# EAGLE design AFC_senser_carrier_v3a (EAGLE 9.6.2)

## Sheet 1 of 4: Power regulation 7V, 5V, 3.3V

## Sheet 2 of 4: 3 of TGS26XX sensors, 1 NGM2611E13, 16bit ADS1115
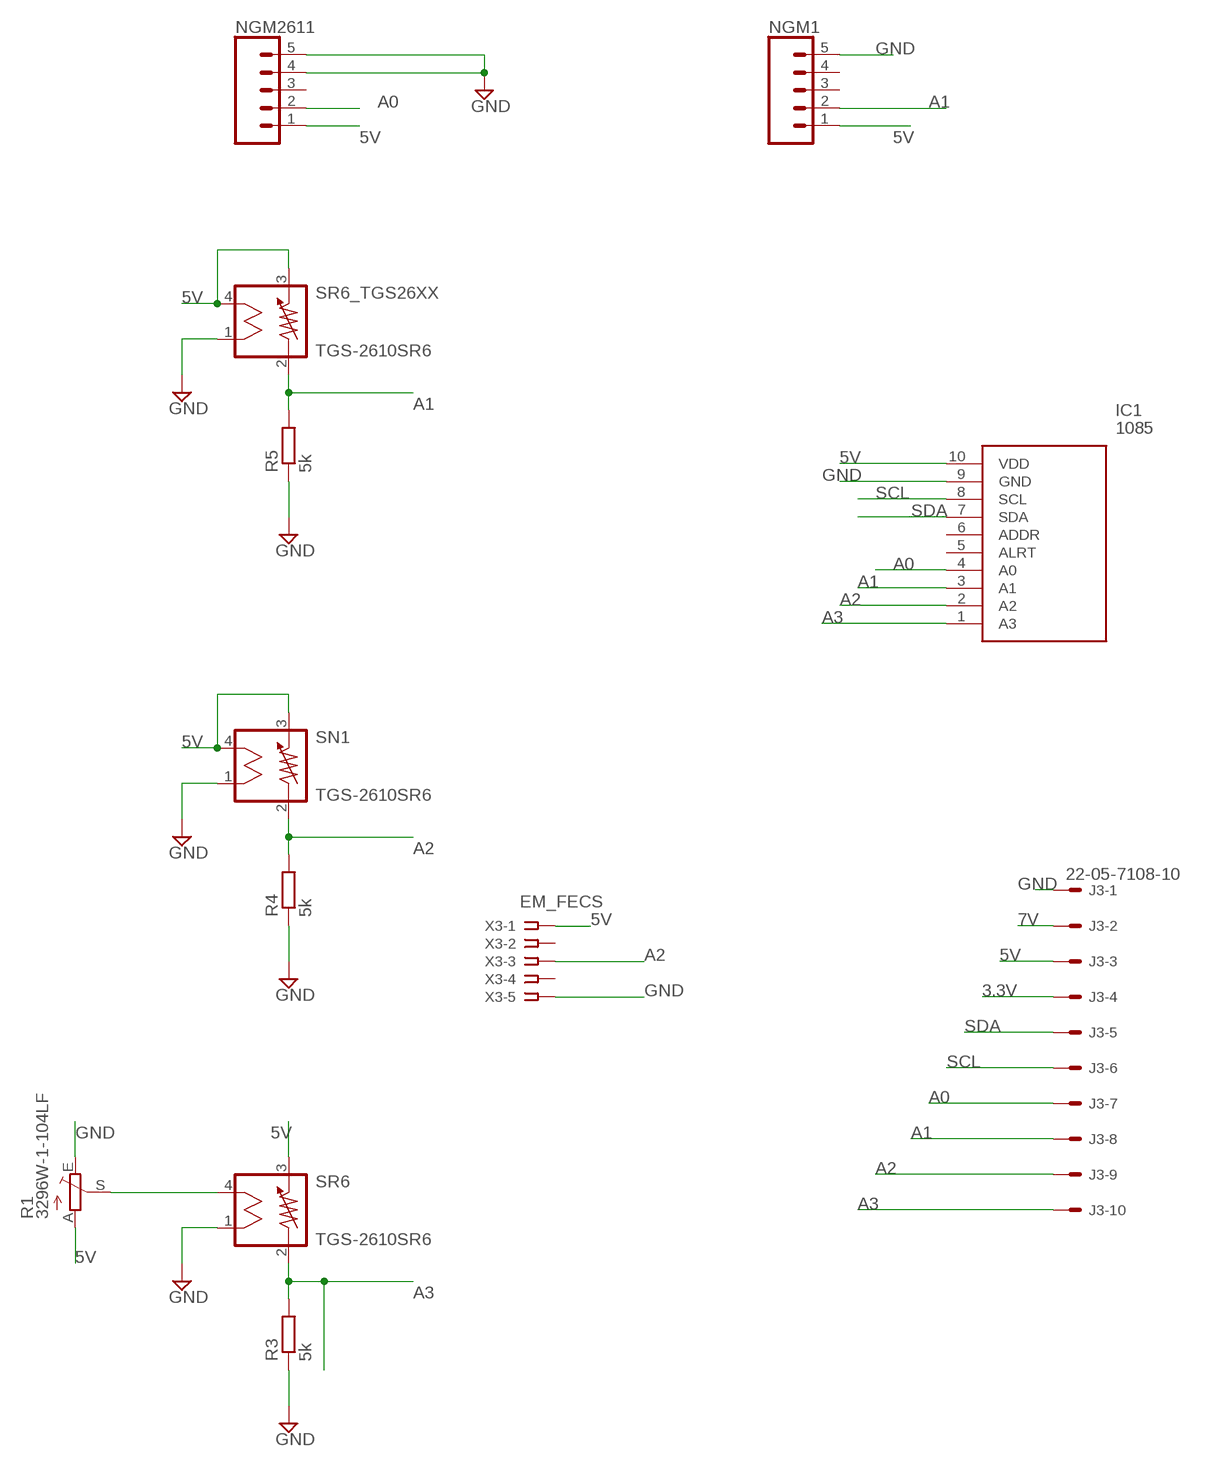
[diagram p0: schematic, sheet 2]

### Parts
IC1  1085  [1085]
J3  22-05-7108-10  [7395-10]
NGM1  CONN_05LOCK  [1X05_LOCK]
NGM2611  CONN_05LOCK  [1X05_LOCK]
R1  3296W-1-104LF  TRIM_EU-S64W  [S64W]
R3  5k  R-EU_R0805  [R0805]
R4  5k  R-EU_R0805  [R0805]
R5  5k  R-EU_R0805  [R0805]
SN1  TGS-2610SR6  [SR6_TGS26XX]
SR6  TGS-2610SR6  [SR6_TGS26XX]
SR6_TGS26XX  TGS-2610SR6  [SR6_TGS26XX]
X3  EM_FECS  SSW-105-02-G-S  [SSW-105-02-G-S]

### Nets
3.3V: J3.4 ; also sheet 3,4
5V [supply]: IC1.10(VDD) J3.3 NGM1.1 NGM2611.1 R1.A SN1.3 SN1.4 SR6.3 SR6_TGS26XX.3 SR6_TGS26XX.4 X3.1 ; also sheet 3
7V: J3.2 ; also sheet 3,4
A0: IC1.4(A0) J3.7 NGM2611.2
A1: IC1.3(A1) J3.8 NGM1.2 R5.2 SR6_TGS26XX.2
A2: IC1.2(A2) J3.9 R4.2 SN1.2 X3.3
A3: IC1.1(A3) J3.10 R3.2 SR6.2
GND: IC1.9(GND) J3.1 NGM1.5 NGM2611.4 NGM2611.5 R1.E R3.1 R4.1 R5.1 SN1.1 SR6.1 SR6_TGS26XX.1 X3.5 ; also sheet 3,4
N$1: R1.S SR6.4
SCL: IC1.8(SCL) J3.6 ; also sheet 3,4
SDA: IC1.7(SDA) J3.5 ; also sheet 3,4
Unconnected: IC1.5(ALRT) IC1.6(ADDR) NGM1.3 NGM1.4 NGM2611.3 X3.2 X3.4

## Sheet 3 of 4: K33, SHT85, BME680_3660 sensors
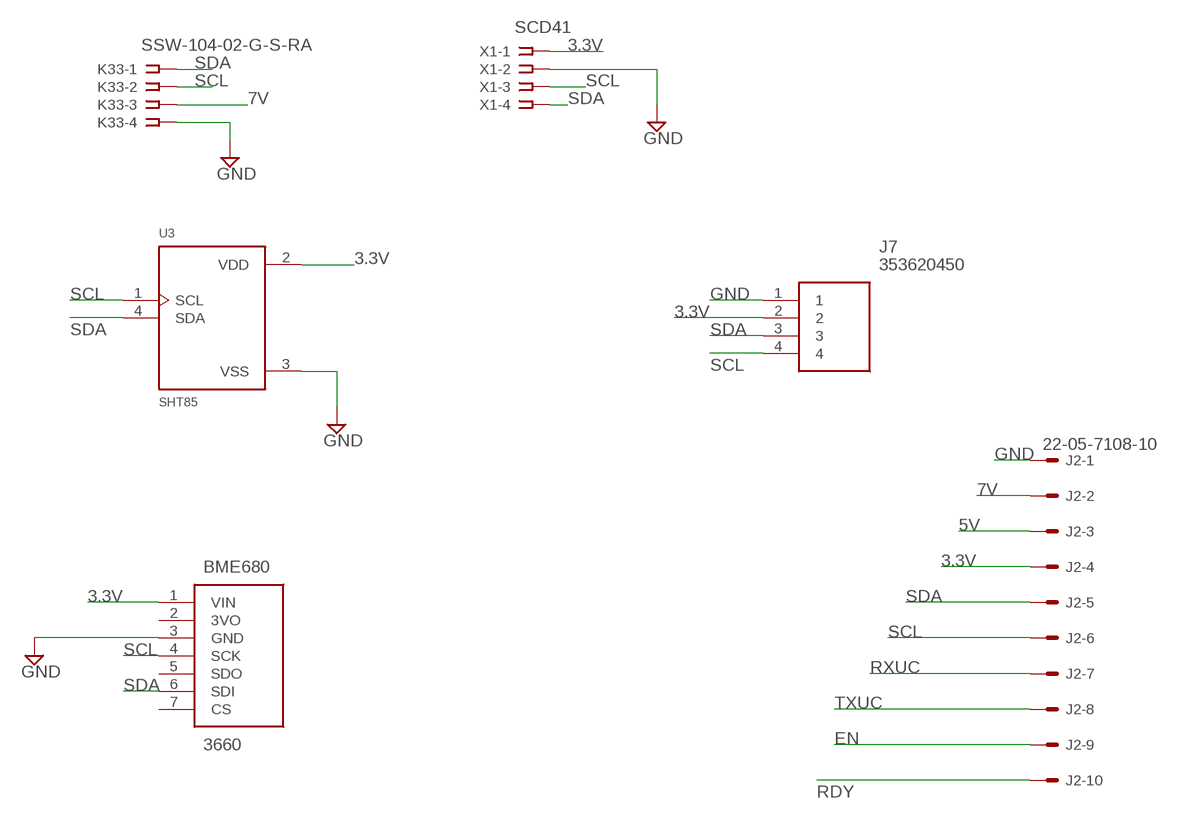
[diagram p1: schematic, sheet 3]

### Parts
BME680  3660  [3660]
J2  22-05-7108-10  [7395-10]
J7  353620450  [SHDR4W50P0X200_1X4_1030X550X85]
K33  SSW-104-02-G-S-RA  [SSW-104-02-G-S-RA]
U3  SHT85  [XDCR_SHT85]
X1  SCD41  SSW-104-02-G-S  [SSW-104-02-G-S]

### Nets
3.3V: BME680.1(VIN) J2.4 J7.2 U3.2(VDD) X1.1 ; also sheet 2,4
5V [supply]: J2.3 ; also sheet 2
7V: J2.2 K33.3 ; also sheet 2,4
EN: J2.9 ; also sheet 4
GND: BME680.3(GND) J2.1 J7.1 K33.4 U3.3(VSS) X1.2 ; also sheet 2,4
RDY: J2.10 ; also sheet 4
RXUC: J2.7 ; also sheet 4
SCL: BME680.4(SCK) J2.6 J7.4 K33.2 U3.1(SCL) X1.3 ; also sheet 2,4
SDA: BME680.6(SDI) J2.5 J7.3 K33.1 U3.4(SDA) X1.4 ; also sheet 2,4
TXUC: J2.8 ; also sheet 4
Unconnected: BME680.2(3VO) BME680.5(SDO) BME680.7(CS)

## Sheet 4 of 4: Arduino MKR, Sunrise, K96
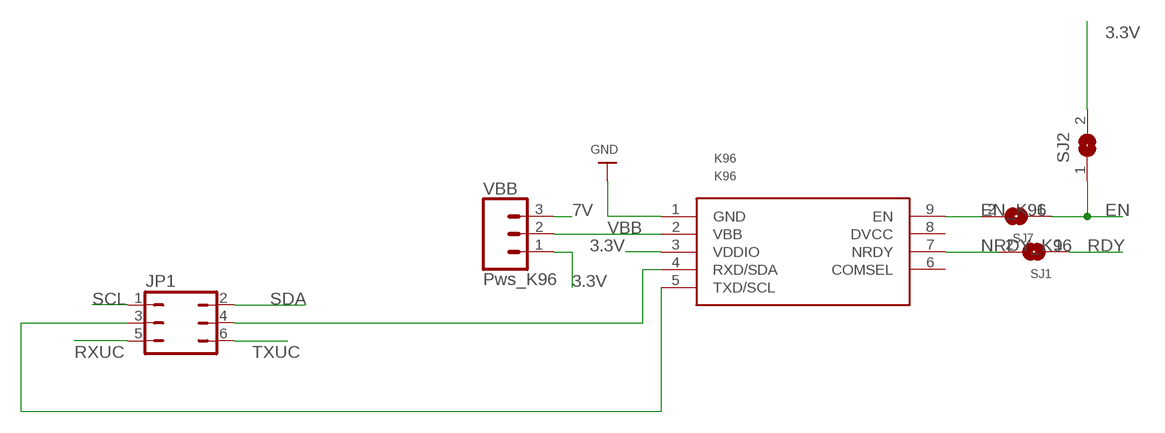
[diagram p2: schematic, sheet 4]

### Parts
JP1  JP3Q  [JP3Q]
K96  K96  SENSEAIR_SUNRISESUNRISE  [SENSEAIR_SUNRISE]
SJ1  SOLDERJUMPERCLOSED  [SOLDERJUMPER_CLOSEDWIRE]
SJ2  SJ  [SJ]
SJ7  SOLDERJUMPERCLOSED  [SOLDERJUMPER_CLOSEDWIRE]
VBB  Pws_K96  CONN_03  [1X03]

### Nets
3.3V: K96.3(VDDIO) SJ2.2 VBB.1 ; also sheet 2,3
7V: VBB.3 ; also sheet 2,3
EN: SJ2.1 SJ7.1 ; also sheet 3
EN_K96: K96.9(EN) SJ7.2
GND: K96.1(GND) ; also sheet 2,3
NRDY_K96: K96.7(NRDY) SJ1.2
RDY: SJ1.1 ; also sheet 3
RX_MKR: JP1.3 K96.5(TXD/SCL)
RXUC: JP1.5 ; also sheet 3
SCL: JP1.1 ; also sheet 2,3
SDA: JP1.2 ; also sheet 2,3
TX_MKR: JP1.4 K96.4(RXD/SDA)
TXUC: JP1.6 ; also sheet 3
VBB: K96.2(VBB) VBB.2
Unconnected: K96.6(COMSEL) K96.8(DVCC)

## Library data of the parts
BME680 = SamacSys_Parts:3660: Multiple Function Sensor Development Tools Adafruit BME680 - T, H, P & G Sensor Source: Datasheet <https://cdn-learn.adafruit.com/downloads/pdf/adafruit-bme680-humidity-temperature-barometic-pressure-voc-gas.pdf>; ARROW_PART_NUMBER: 3660; ARROW_PRICE-STOCK: https://www.arrow.com/en/products/3660/adafruit-industries; DESCRIPTION: Multiple Function Sensor Development Tools Adafruit BME680 - T, H, P & G Sensor; HEIGHT: 4mm; MANUFACTURER_NAME: Adafruit; MANUFACTURER_PART_NUMBER: 3660; MOUSER_PART_NUMBER: 485-3660; MOUSER_PRICE-STOCK: https://www.mouser.co.uk/ProductDetail/Adafruit/3660?qs=W0yvOO0ixfFypXCClAyRMg%3D%3D
IC1 = SamacSys_Parts:1085: Data Conversion IC Development Tools ADS1115 16-Bit ADC - 4 Channel with Programmable Gain Amplifier Source: Datasheet <https://cdn-shop.adafruit.com/datasheets/ads1115.pdf>; ARROW_PART_NUMBER: 1085; ARROW_PRICE-STOCK: https://www.arrow.com/en/products/1085/adafruit-industries; DESCRIPTION: Data Conversion IC Development Tools ADS1115 16-Bit ADC - 4 Channel with Programmable Gain Amplifier; HEIGHT: 5mm; MANUFACTURER_NAME: Adafruit; MANUFACTURER_PART_NUMBER: 1085; MOUSER_PART_NUMBER: 485-1085; MOUSER_PRICE-STOCK: https://www.mouser.co.uk/ProductDetail/Adafruit/1085?qs=GURawfaeGuCW8oufi8WauA%3D%3D
J2 J3 = con-molex:22-?-10: CONNECTOR wire to board 2.54 mm (.1 inch) pitch header; MF: MOLEX; OC_FARNELL: unknown; OC_NEWARK: unknown
J7 = SamacSys_Parts:353620450: MOLEX - 353620450 - CONNECTOR, HEADER, 4POS, 1ROW, 2MM Source: Datasheet <https://www.molex.com/pdm_docs/sd/353620450_sd.pdf>; DESCRIPTION: MOLEX - 353620450 - CONNECTOR, HEADER, 4POS, 1ROW, 2MM; HEIGHT: 8.5mm; MANUFACTURER_NAME: Molex; MANUFACTURER_PART_NUMBER: 353620450
JP1 = jumper:JP3Q: JUMPER
K33 = con-samtec:SSW-104-02-G-S: THROUGH-HOLE .025" SQ POST SOCKET Source: Samtec SSW.pdf; MF: Samtec Inc.; MPN: SSW-104-02-G-S-RA; OC_FARNELL: unknown; OC_NEWARK: 11P9385
K96 = Senseair_Sunrise:SENSEAIR_SUNRISE
NGM1 NGM2611 = SparkFun-Connectors:CONN_05: Multi connection point. Often used as Generic Header-pin footprint for 0.1 inch spaced/style header connections On any of the 0.1 inch spaced packages, you can populate with these: Break Away Headers - Straight <https://www.sparkfun.com/products/116> (PRT-00116) Break Away Male Headers - Right Angle <https://www.sparkfun.com/products/553> (PRT-00553) Female Headers <https://www.sparkfun.com/products/115> (PRT-00115) Break Away Headers - Machine Pin <https://www.sparkfun.com/products/117> (PRT-00117) Break Away Female Headers - Swiss Machine Pin <https://www.sparkfun.com/products/743> (PRT-00743) For SCREWTERMINALS and SPRING TERMINALS visit here: Screw Terimnals on SparkFun.com <https://www.sparkfun.com/search/results?term=Screw+Terminals> (5mm/3.5mm/2.54mm spacing) This device is also useful as a general connection point to wire up your design to another part of your project. Our various solder wires solder well into these plated through hole pads. Hook-Up Wire - Assortment (Stranded, 22 AWG) <https://www.sparkfun.com/products/11375> (PRT-11375) Hook-Up Wire - Assortment (Solid Core, 22 AWG) <https://www.sparkfun.com/products/11367> (PRT-11367) View the entire wire category on our website here <https://www.sparkfun.com/categories/141> Special notes: Molex polarized connector foot print use with SKU : PRT-08231 with associated crimp pins and housings. 1MM SMD Version SKU: PRT-10208
R1 = pot:TRIM_EU-: POTENTIOMETER
R3-R5 = rcl:R-EU_: RESISTOR, European symbol; SPICEPREFIX: R
SJ1 SJ7 = microbuilder:SOLDERJUMPER: SMD Solder JUMPER Solder the two pads together to create a connection, or remove the solder to break it. REFLOW - Use this footprint for solder paste and reflow ovens. WAVE - Use this footprint for hand-soldering (larger pads). CLOSED - Has a trace between the two pads to ensure it is closed by default. The trace needs to be cut to disable the jumper, and can be closed again by creating a solder bridge between the two pads.
SJ2 = jumper:SJ: SMD solder JUMPER
SN1 SR6 SR6_TGS26XX = figaro:TGS-2610: SENSOR TGS 2610 - Gas Sensor
U3 = SHT85:SHT85: SENSOR HUMID/TEMP Check prices <https://pricing.snapeda.com/search/part/SHT85/?ref=eda>; AVAILABILITY: Good; DESCRIPTION: Humidity Temperature Sensor 0 ~ 100% RH Digital ±1.5% RH 8s Through Hole; MF: Sensirion AG; MP: SHT85; PACKAGE: SIP-4 Sensirion AG; PRICE: None; PURCHASE-URL: https://pricing.snapeda.com/search/part/SHT85/?ref=eda
VBB = SparkFun-Connectors:CONN_03: Multi connection point. Often used as Generic Header-pin footprint for 0.1 inch spaced/style header connections On any of the 0.1 inch spaced packages, you can populate with these: Break Away Headers - Straight <https://www.sparkfun.com/products/116> (PRT-00116) Break Away Male Headers - Right Angle <https://www.sparkfun.com/products/553> (PRT-00553) Female Headers <https://www.sparkfun.com/products/115> (PRT-00115) Break Away Headers - Machine Pin <https://www.sparkfun.com/products/117> (PRT-00117) Break Away Female Headers - Swiss Machine Pin <https://www.sparkfun.com/products/743> (PRT-00743) Stackable Header - 3 Pin (Female, 0.1") <https://www.sparkfun.com/products/13875> (PRT-13875) For SCREWTERMINALS and SPRING TERMINALS visit here: Screw Terimnals on SparkFun.com <https://www.sparkfun.com/search/results?term=Screw+Terminals> (5mm/3.5mm/2.54mm spacing) This device is also useful as a general connection point to wire up your design to another part of your project. Our various solder wires solder well into these plated through hole pads. Hook-Up Wire - Assortment (Stranded, 22 AWG) <https://www.sparkfun.com/products/11375> (PRT-11375) Hook-Up Wire - Assortment (Solid Core, 22 AWG) <https://www.sparkfun.com/products/11367> (PRT-11367) View the entire wire category on our website here <https://www.sparkfun.com/categories/141> Special notes: Molex polarized connector foot print use with SKU : PRT-08232 with associated crimp pins and housings.
X1 = con-samtec:SSW-104-02-G-S: THROUGH-HOLE .025" SQ POST SOCKET Source: Samtec SSW.pdf; MF: Samtec Inc.; MPN: SSW-104-02-G-S; OC_FARNELL: unknown; OC_NEWARK: 11P9384
X3 = con-samtec:SSW-105-02-G-S: THROUGH-HOLE .025" SQ POST SOCKET Source: Samtec SSW.pdf; MF: Samtec Inc.; MPN: SSW-105-02-G-S; OC_FARNELL: unknown; OC_NEWARK: 11P9399

## Net classes
1 supply: width 0.584 mm, clearance 0.508 mm

## Board
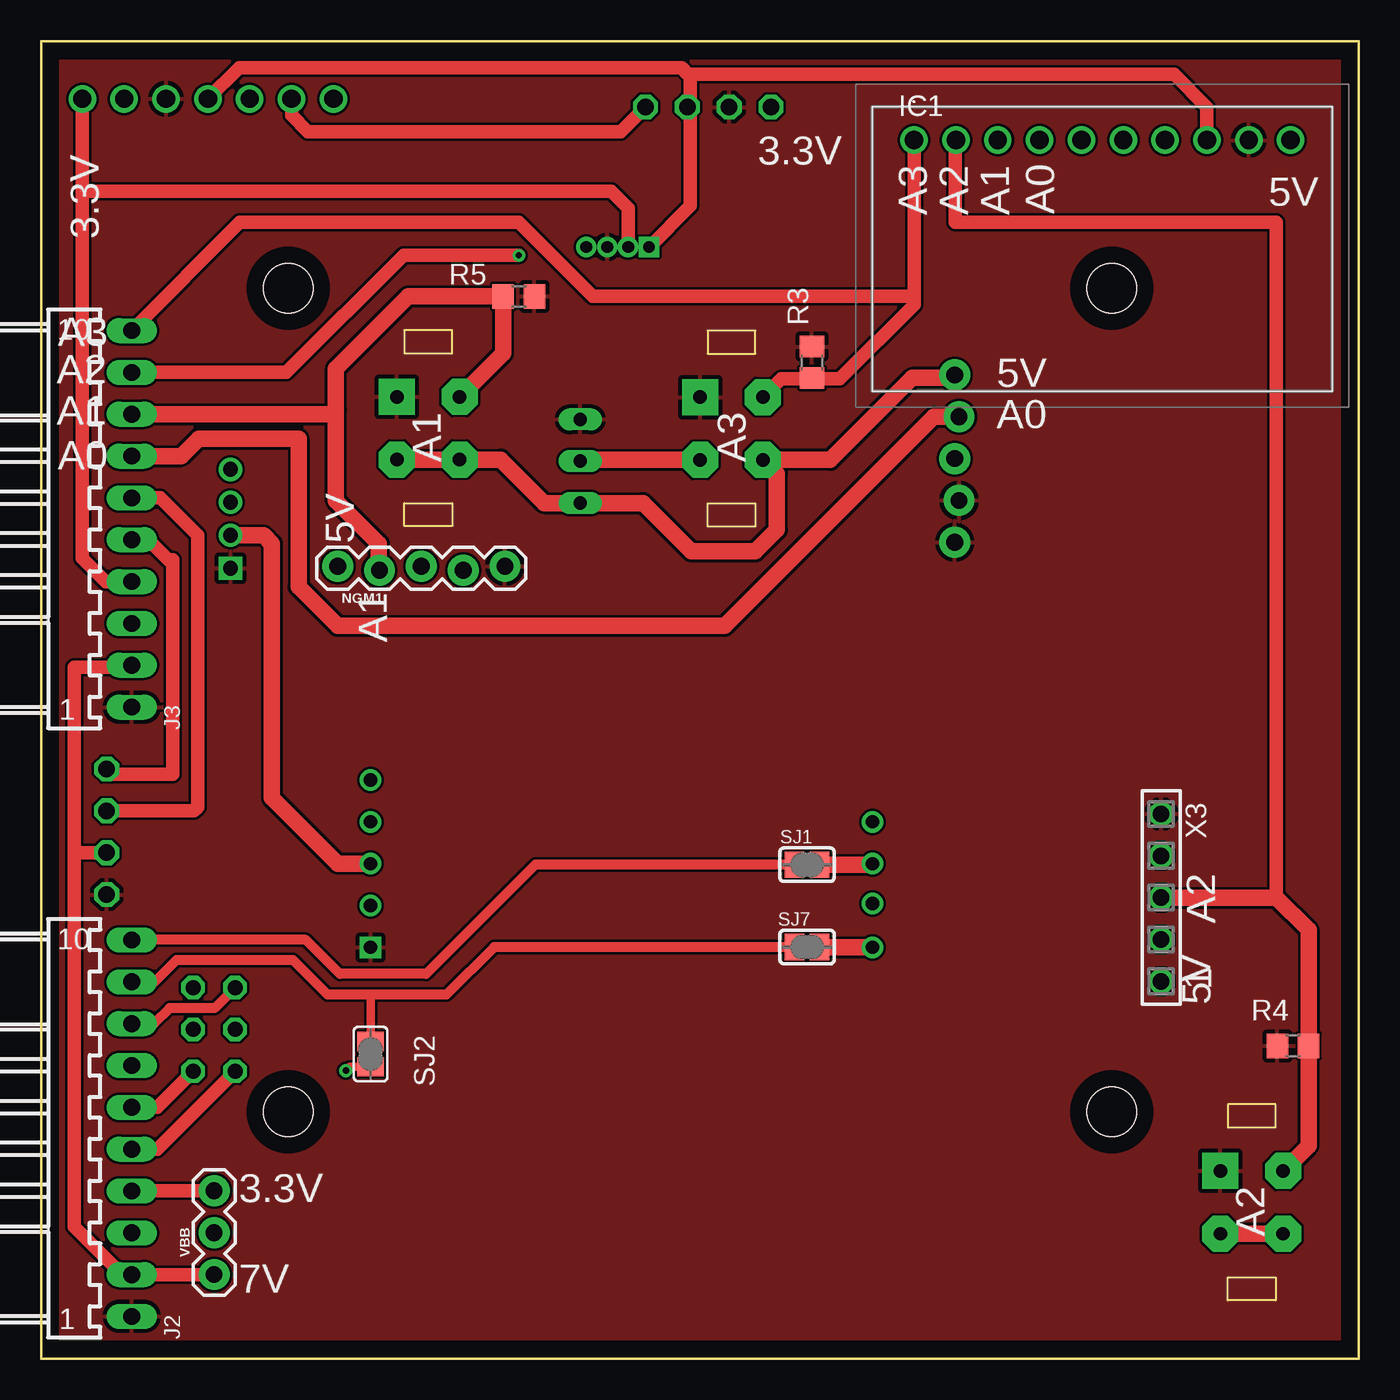
[diagram p3: board, top side]
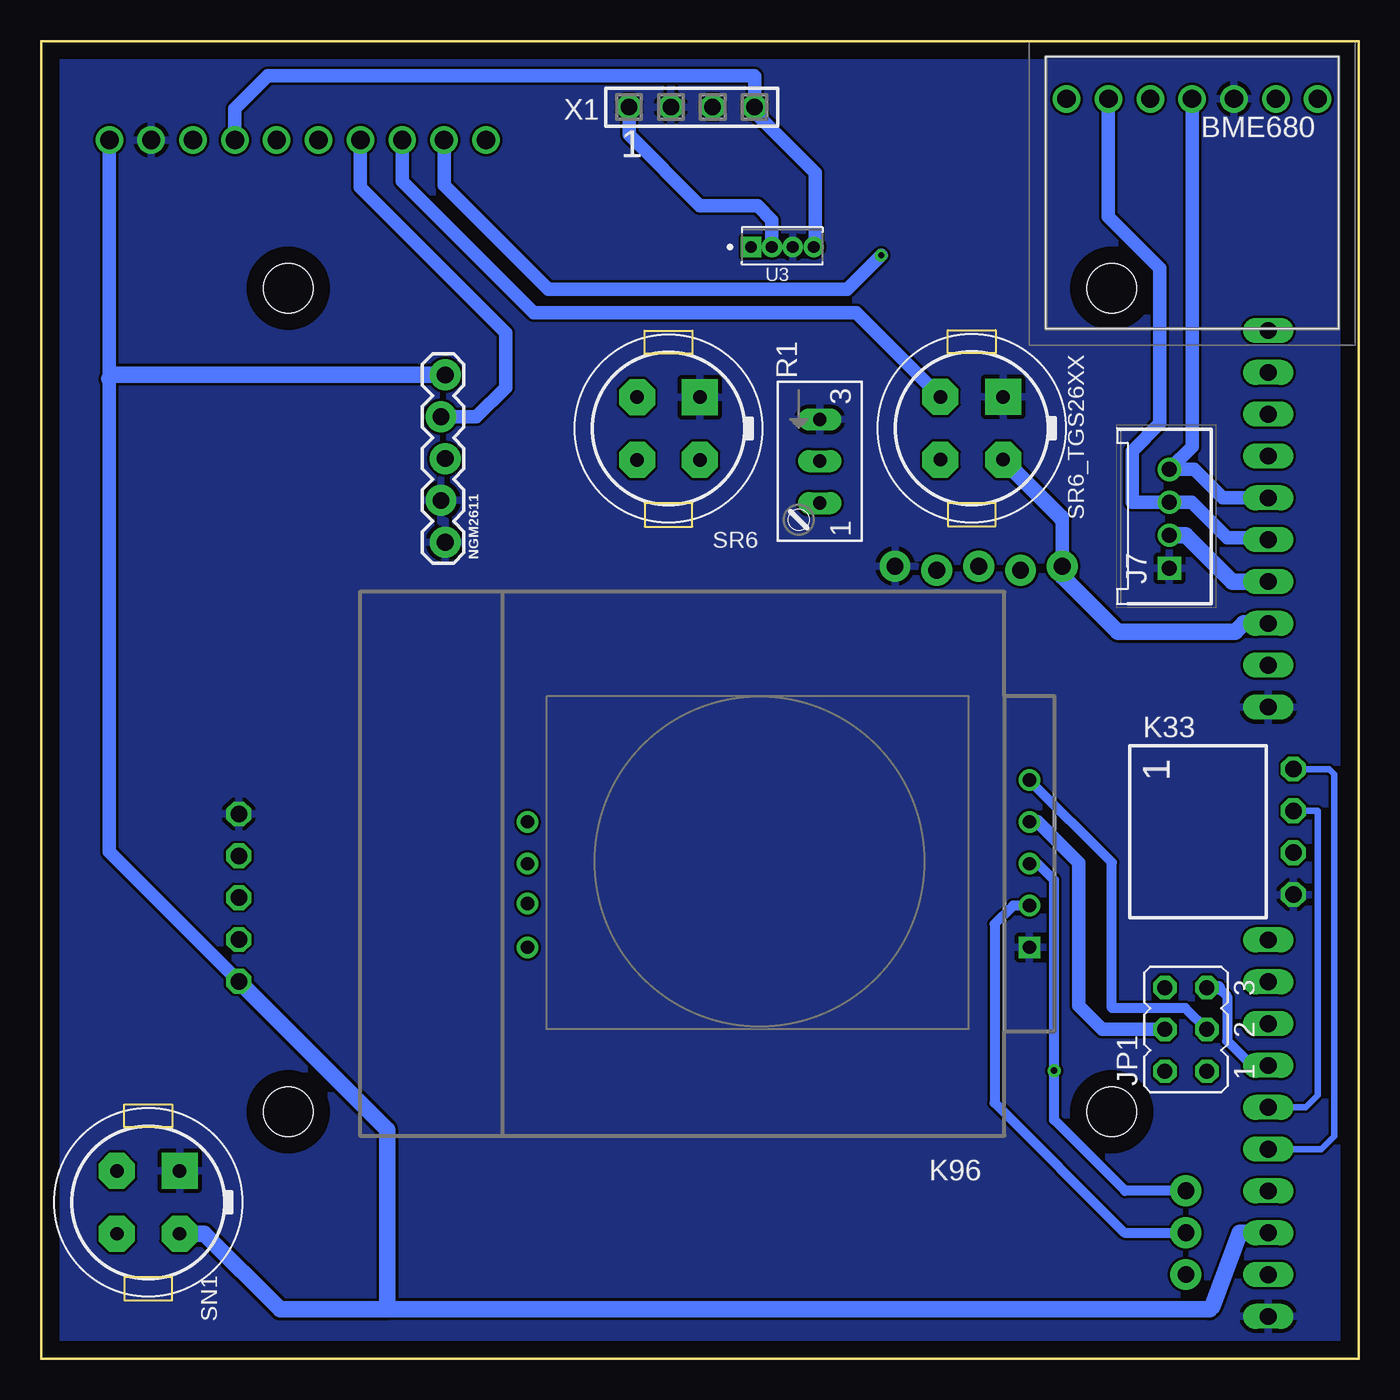
[diagram p4: board, bottom side, seen from below]

Size 80 x 80 mm. Coordinates in mm from the lower left corner, seen from the top.
Outline: 0,0 0,80 80,80 80,0 0,0
Copper layers (1*16): Top 0.035mm / dielectric 1.5mm / Bottom 0.035mm
Design rules "default": minimum track width 6mil, minimum drill 0.35mm, track to track 6mil, track to pad 6mil, pad to pad 6mil, via to via 6mil, smd to smd 6mil, copper to edge 40mil, drill to drill 6mil, minimum pad ring 10mil, minimum via ring 8mil, stop-mask expansion 4mil, vias tented up to drill 0mil, thermal gap 10mil
Holes 3 mm at 15,65 15,15 65,65 65,15

### Footprints (pad centres in the part's own frame; a part is rotated, then mirrored left to right if it is on the bottom)
3660 = drill 1.11 pad 1.665: 1 0,0; 2 2.54,0; 3 5.08,0; 4 7.62,0; 5 10.16,0; 6 12.7,0; 7 15.24,0
1085 = drill 1.11 pad 1.665: 1 0,0; 2 -2.54,0; 3 -5.08,0; 4 -7.62,0; 5 -10.16,0; 6 -12.7,0; 7 -15.24,0; 8 -17.78,0; 9 -20.32,0; 10 -22.86,0
7395-10 = drill 1.016 long: 1 11.43,0; 2 8.89,0; 3 6.35,0; 4 3.81,0; 5 1.27,0; 6 -1.27,0; 7 -3.81,0; 8 -6.35,0; 9 -8.89,0; 10 -11.43,0
SHDR4W50P0X200_1X4_1030X550X85 = drill 0.9 pad 1.35 square: 1 0,0 | drill 0.9 pad 1.35: 2 -2,0; 3 -4,0; 4 -6,0
JP3Q = drill 0.914 octagon: 1 -2.54,-1.27; 2 -2.54,1.27; 3 0,-1.27; 4 0,1.27; 5 2.54,-1.27; 6 2.54,1.27
SSW-104-02-G-S-RA = drill 1 pad 1.5 octagon: 1 -3.81,1.524; 2 -1.27,1.524; 3 1.27,1.524; 4 3.81,1.524
SENSEAIR_SUNRISE = drill 0.8 square: 1 -0.005,0.02 | drill 0.8: 2 -0.005,-2.52; 3 -0.005,-5.06; 4 -0.005,-7.6; 5 -0.005,-10.14; 6 30.475,-7.6; 7 30.475,-5.06; 8 30.475,-2.647; 9 30.475,0.02
1X05_LOCK = drill 1.016 pad 1.88: 1 0,0.127; 2 2.54,-0.127; 3 5.08,0.127; 4 7.62,-0.127; 5 10.16,0.127
S64W = drill 0.813 long: A 2.54,1.27; E -2.54,1.27; S 0,1.27
R0805 = smd 1.3 x 1.5: 1 -0.95,0; 2 0.95,0
SOLDERJUMPER_CLOSEDWIRE = smd 1.168 x 1.6: 1 -0.762,0; 2 0.762,0 | smd 0.635 x 0.203: WIRE 0,0
SJ = smd 1.168 x 1.6: 1 -0.762,0; 2 0.762,0
SR6_TGS26XX = drill 0.813 pad 2.184 square: 1 -1.905,1.905 | drill 0.813 pad 2.184 octagon: 2 -1.905,-1.905; 3 1.905,-1.905; 4 1.905,1.905
XDCR_SHT85 = drill 0.72 pad 1.1 square: 1 -1.905,0 | drill 0.72 pad 1.1: 2 -0.635,0; 3 0.635,0; 4 1.905,0
1X03 = drill 1.016 pad 1.88: 1 0,0; 2 2.54,0; 3 5.08,0
SSW-104-02-G-S = drill 1 pad 1.5 octagon: 1 -3.81,0; 2 -1.27,0; 3 1.27,0; 4 3.81,0
SSW-105-02-G-S = drill 1 pad 1.5 octagon: 1 -5.08,0; 2 -2.54,0; 3 0,0; 4 2.54,0; 5 5.08,0

### Placement (x,y rotation side)
BME680  2.5,76.5 180 bottom
IC1  53,74 180 top
J2  5.5,14 270 top
J3  5.5,51 270 top
J7  11.5,48 270 bottom
JP1  10.5,20 90 bottom
K33  5.5,32 270 bottom
K96  20,25 180 bottom
NGM1  18,48 0 top
NGM2611  55.6,59.74 270 bottom
R1  34,54.5 270 bottom
R3  46.8,60.5 270 top
R4  76,19 0 top
R5  29,64.5 180 top
SJ1  46.5,30 0 top
SJ2  20,18.5 270 top
SJ7  46.5,25 0 top
SN1  73.5,9.5 270 bottom
SR6  41.92,56.48 270 bottom
SR6_TGS26XX  23.5,56.5 270 bottom
U3  35,67.5 0 bottom
VBB  10.5,10.2 270 top
X1  40.5,76 0 bottom
X3  68,28 90 top

### Tracks (layer width: path | path; a pad name or v marks a point on that pad's centre or on a via)
3.3V  (via drill 0.38)
  Top 0.508: SJ2.2 18.74,17.74 v18.5,17.5
  Top 0.813: J2.4 VBB.1 | J3.4 3.91,47.19 2.5,48.6 BME680.1 2.5,70.89 34.61,70.89 35.63,69.86 U3.2
  Top 1.016: J7.2 13.5,50 14,49.5 14,34.05 18,30.06 K96.3
  Bottom 0.61: K96.3 19.5,30.06 18.5,29.07 v18.5,17.5 18.5,14.51 14.19,10.2 VBB.1
  Bottom 0.813: X1.1 44.31,74.31 40,70 36.5,70 35.63,69.14 U3.2
  Bottom 1.016: J7.2 10.5,50 7.69,47.19 J3.4
5V
  Top 0.813: NGM2611.1 55.41,59.55
  Top 1.016: 55.41,59.55 52.89,59.55 47.91,54.58 SR6.3 44.67,53.73 44.67,50.33 43.37,49.02 39.48,49.02 36.54,51.96 R1.A 30.54,51.96 27.91,54.59 SR6_TGS26XX.3 SR6_TGS26XX.4 | SN1.3 SN1.4
  Bottom 0.813: IC1.10 75.86,59.5 75.86,30.78 X3.1 | 18.09,51.09 18,51 NGM1.1
  Bottom 1.016: J3.3 7,44.65 7.5,44.15 14.65,44.15 18,47.5 NGM1.1 | SR6_TGS26XX.4 18.09,51.09 | SN1.4 70.09,7.59 65.5,3 59,3 | X3.1 59,13.92 59,3 | NGM2611.1 75.62,59.74 75.86,59.5 | J2.3 7.24,7.65 8.9,3.15 9.05,3 59,3
7V
  Top 0.813: J3.2 5.39,42 2,42 2,30.73 | 2,30.73 K33.3 | VBB.3 J2.2 4.91,5.11 2,8.02 2,30.73
A0
  Top 1.016: J3.7 8.5,54.81 9.55,55.86 15.64,55.86 15.64,46.86 18,44.5 41.5,44.5 54.2,57.2 NGM2611.2
  Bottom 0.813: IC1.4 60.62,71.12 51.8,62.3 51.8,58.97 53.58,57.2 NGM2611.2
A1
  Top 1.016: SR6_TGS26XX.2 28.05,61.05 R5.2 22.28,64.5 17.89,60.11 17.89,57.61 | J3.8 17.63,57.35 17.89,57.61 | NGM1.2 20.5,47.91 20.5,49.5 17.89,52.11 17.89,57.61
  Bottom 0.813: SR6_TGS26XX.2 30.5,63.5 50.08,63.5 58.08,71.5 IC1.3
A2  (via drill 0.35)
  Top 0.813: 75,28 75,69 55.5,69 55.5,73.96 IC1.2 | J3.9 14.89,59.89 22,67 v29,67
  Top 1.016: SN1.2 76.95,12.95 R4.2 76.95,26.05 75,28 X3.3
  Bottom 0.813: v29,67 31.07,64.93 49.21,64.93 55.54,71.26 IC1.2
A3
  Top 0.813: J3.10 12.07,69 29,69 33.5,64.5 53,64.5 | IC1.1 53,64.5 | 53,64.5 53,64 48.5,59.5 46.85,59.5 | 46.85,59.5 R3.2 | SR6.2 44.93,59.5 46.85,59.5
EN
  Top 0.508: SJ2.1 20,22.11
  Top 0.61: J2.9 6.89,22.89 8.21,24.21 15.29,24.21 17.39,22.11 20,22.11 24.61,22.11 27.5,25 SJ7.1
EN_K96
  Top 1.016: SJ7.2 50.45,25 K96.9
GND
  pour Bottom: 0,80 80,80 80,0 0,0
  pour Top: 0,0 80,0 80,80 0,80
N$1
  Top 1.016: R1.S 32.81,54.58 SR6.4
NRDY_K96
  Top 1.016: K96.7 50.41,30 SJ1.2
RDY
  Top 0.61: 45.73,30 30,30 23.37,23.37 18.13,23.37 16.07,25.43 J2.10
  Top 1.016: SJ1.1 45.73,30
RX_MKR
  Bottom 0.61: JP1.3 10.53,21.3 15,21.3 15,30.14 K96.5
RXUC
  Bottom 0.61: 8.54,22.54 8,22 8,19.31 6.5,17.81 J2.7
  Bottom 0.813: JP1.5 8.54,22.54
SCL
  Top 0.813: 39.41,78 39.41,76 | 39.41,76 39.41,70 U3.1 | K33.2 9.27,33.27 9.5,33.5 9.5,50 7.23,52.27 J3.6 | 39.41,78 68.78,78 70.78,76 IC1.8 | BME680.4 12.01,78.39 38.88,78.39 39.27,78 39.41,78 | JP1.1 7.04,15.27 J2.6 | X1.3 39.41,76
  Bottom 0.406: J2.6 3.23,15.27 2.5,16 2.5,33.27 K33.2
  Bottom 0.813: BME680.4 10.12,55.38 J7.4 10,54 8.27,52.27 J3.6
SDA
  Top 0.813: K33.1 4.29,35.5 8,35.5 8,48.51 7.72,48.51 6.5,49.73 J3.5 | JP1.2 7.04,12.73 J2.5 | BME680.6 15.2,75.5 16.2,74.5 35.19,74.5 X1.4
  Bottom 0.406: K33.1 1.81,35.81 1.5,35.5 1.5,13.5 2.27,12.73 J2.5
  Bottom 0.813: J3.5 5.62,49.85 8,49.85 10.15,52 J7.3 13.76,52 13.76,55.1 12.08,56.79 12.08,66.21 15.2,69.33 BME680.6 | IC1.7 68.24,75.89 66.24,77.89 36.7,77.89 36.69,77.88 X1.4 36.69,75.69 33,72 33,67.59 U3.4
TX_MKR
  Bottom 0.813: K96.4 19.5,32.6 17,30.11 17,21.43 15.56,20 JP1.4
TXUC
  Top 0.61: JP1.6 10.53,21.3 7.8,21.3 6.85,20.35 J2.8
VBB
  Bottom 0.61: K96.2 21,27.52 22.11,26.41 22.11,15.54 14.23,7.66 VBB.2

### Text on the board
tNames: 3.3V | A3 | A2 | A1 | A0 | 5V | 3.3V | A3 | A2 | 5V | A1 | A1 | A3 | A0 | A0 | 5V | A1 | A2 | 5V | 3.3V | A2 | 7V
Document: SDA | SCL | SCL | SDA | SCL | SDA | SDA | SCL | Vin | GND